# EAGLE design EsquematicoPotencia (EAGLE 9.1.3)
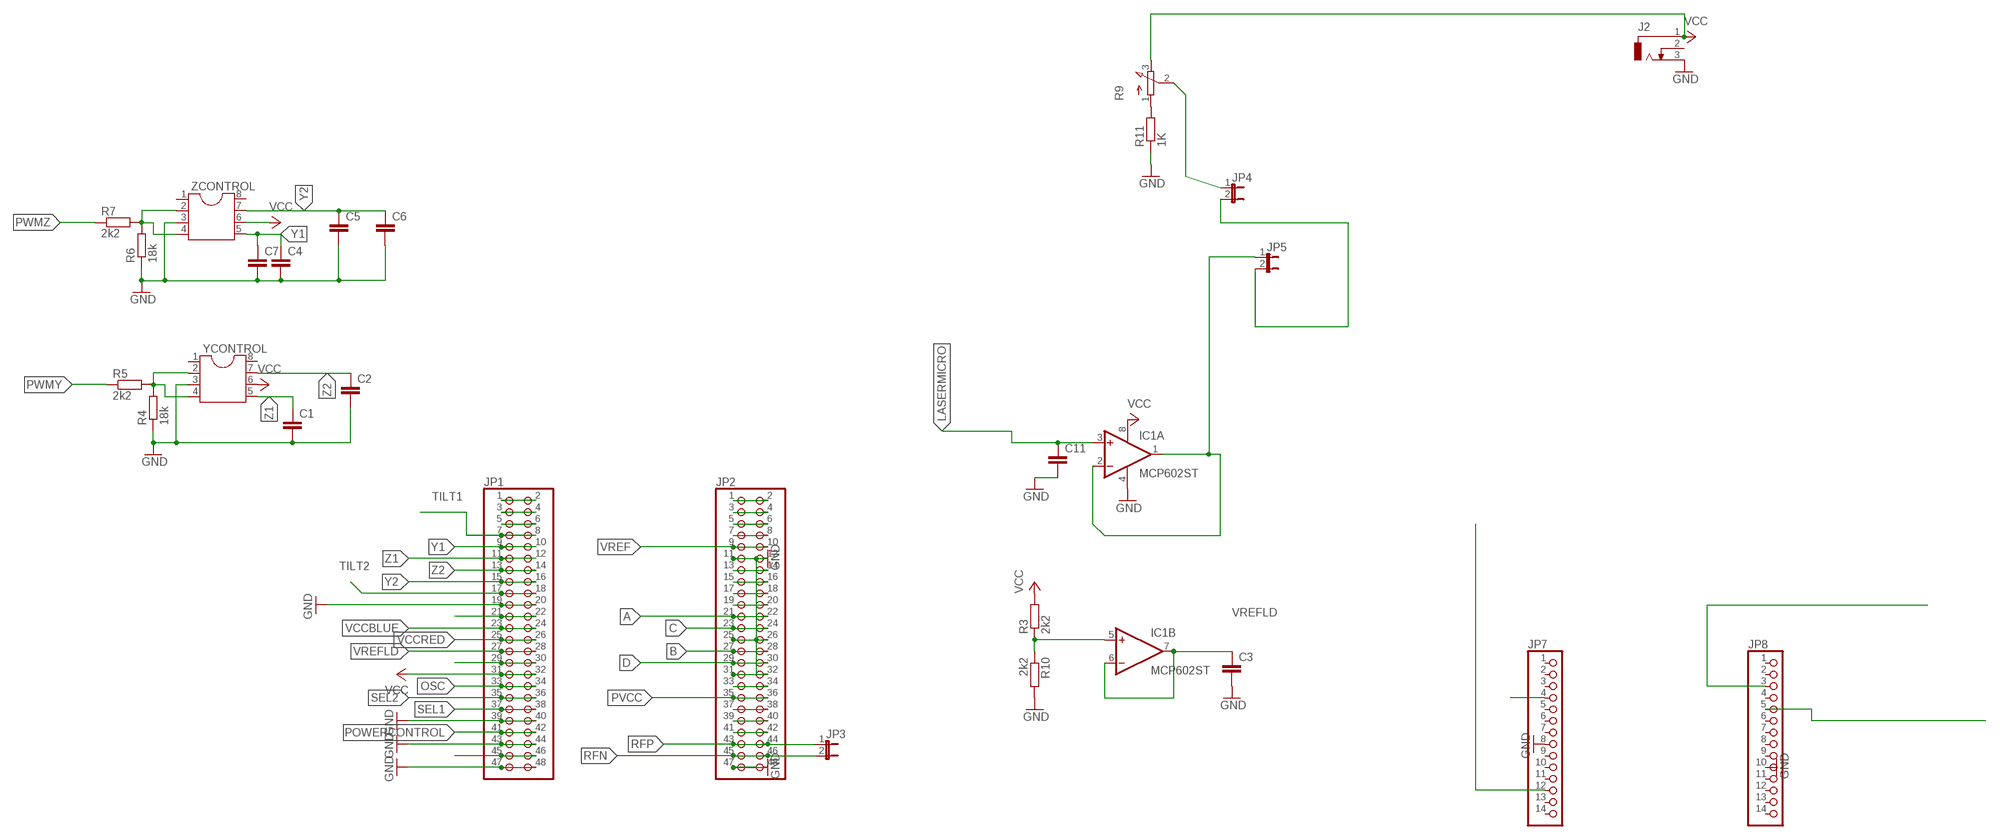
[diagram p0: schematic, sheet 1]

## Parts
C1  C-EU025-024X044  [C025-024X044]
C2  C-EU025-024X044  [C025-024X044]
C3  C-EU025-024X044  [C025-024X044]
C4  C-EU025-024X044  [C025-024X044]
C5  C-EU025-024X044  [C025-024X044]
C6  C-EU025-024X044  [C025-024X044]
C7  C-EU025-024X044  [C025-024X044]
C11  C-EU025-024X044  [C025-024X044]
IC1  MCP602ST  [TSSOP8]
J2  DCJ0303  [DCJ0303]
JP1  PINHD-2X24  [2X24]
JP2  PINHD-2X24  [2X24]
JP3  JP1E  [JP1]
JP4  JP1E  [JP1]
JP5  JP1E  [JP1]
JP7  PINHD-1X14  [1X14]
JP8  PINHD-1X14  [1X14]
R3  2k2  R-EU_0204/7  [0204/7]
R4  18k  R-EU_0204/7  [0204/7]
R5  2k2  R-EU_0204/7  [0204/7]
R6  18k  R-EU_0204/7  [0204/7]
R7  2k2  R-EU_0204/7  [0204/7]
R9  3RP/1610N  [3RP/1610N]
R10  2k2  R-EU_0204/7  [0204/7]
R11  1K  R-EU_0204/7  [0204/7]
YCONTROL  DIL8  [DIL08]
ZCONTROL  DIL8  [DIL08]

## Nets
A: JP2.21 JP2.22
B: JP2.27 JP2.28
C: JP2.23 JP2.24
D: JP2.29 JP2.30
GND: C1.2 C2.2 C3.2 C4.2 C5.2 C6.2 C7.2 C11.2 IC1.4(P:V-) J2.3 JP1.19 JP1.20 JP1.39 JP1.40 JP1.43 JP1.44 JP1.47 JP1.48 JP2.11 JP2.12 JP2.25 JP2.26 JP2.31 JP2.32 JP2.47 JP2.48 JP7.8 JP8.10 R4.1 R6.1 R10.2 R11.1 YCONTROL.3 ZCONTROL.3
LASERMICRO: C11.1 IC1.3(A:+IN) JP7.4
N$1: JP1.21 JP1.22
N$2: JP1.1 JP1.2
N$3: R9.1(A) R11.2
N$4: R4.2 R5.2 YCONTROL.2 YCONTROL.4
N$5: R6.2 R7.2 ZCONTROL.2 ZCONTROL.4
N$6: JP1.29 JP1.30
N$7: JP1.3 JP1.4
N$8: IC1.5(B:+IN) R3.1 R10.1
N$9: JP4.1 R9.2(S)
N$10: JP1.5 JP1.6
N$11: IC1.1(A:OUT) IC1.2(A:-IN) JP5.1
N$12: JP2.1 JP2.2
N$13: JP2.3 JP2.4
N$14: JP1.45 JP1.46
N$15: JP2.5 JP2.6
N$16: JP2.7 JP2.8
N$17: JP2.13 JP2.14
N$18: JP2.15 JP2.16
N$19: JP2.17 JP2.18
N$20: JP2.19 JP2.20
N$21: JP2.33 JP2.34
N$22: JP2.37 JP2.38
N$23: JP2.39 JP2.40
N$24: JP2.41 JP2.42
OSC: JP1.33 JP1.34
POWERCONTROL: JP1.41 JP1.42 JP4.2 JP5.2
PVCC: JP2.35 JP2.36
PWMTILT: JP8.5
PWMY: JP7.12 R5.1
PWMZ: JP8.3 R7.1
RFN: JP2.45 JP2.46 JP3.2
RFP: JP2.43 JP2.44 JP3.1
SEL1: JP1.37 JP1.38
SEL2: JP1.35 JP1.36
TILT1: JP1.7 JP1.8
TILT2: JP1.17 JP1.18
VCC: IC1.8(P:V+) J2.1 JP1.31 JP1.32 R3.2 R9.3(E) YCONTROL.6 ZCONTROL.6
VCCBLUE: JP1.23 JP1.24
VCCRED: JP1.25 JP1.26
VREF: JP2.9 JP2.10
VREFLD: C3.1 IC1.6(B:-IN) IC1.7(B:OUT) JP1.27 JP1.28
Y1: C4.1 C7.1 JP1.9 JP1.10 ZCONTROL.5
Y2: C5.1 C6.1 JP1.15 JP1.16 ZCONTROL.7
Z1: C1.1 JP1.11 JP1.12 YCONTROL.5
Z2: C2.1 JP1.13 JP1.14 YCONTROL.7
Unconnected: J2.2 JP7.1 JP7.2 JP7.3 JP7.5 JP7.6 JP7.7 JP7.9 JP7.10 JP7.11 JP7.13 JP7.14 JP8.1 JP8.2 JP8.4 JP8.6 JP8.7 JP8.8 JP8.9 JP8.11 JP8.12 JP8.13 JP8.14 YCONTROL.1 YCONTROL.8 ZCONTROL.1 ZCONTROL.8

## Library data of the parts
C1-C7 C11 = rcl:C-EU: CAPACITOR, European symbol; SPICEPREFIX: C
IC1 = linear:MCP602: Single Op Amp 2.7V to 6.0V Single Supply CMOS Source: http://ww1.microchip.com/downloads/en/DeviceDoc/21314g.pdf
J2 = con-jack:DCJ0303: DC POWER JACK Source: DCJ0303.pdf; OC_FARNELL: unknown; OC_NEWARK: unknown
JP1 JP2 = pinhead:PINHD-2X24: PIN HEADER
JP3-JP5 = jumper:JP1E: JUMPER
JP7 JP8 = pinhead:PINHD-1X14: PIN HEADER
R3-R7 R10 R11 = rcl:R-EU_: RESISTOR, European symbol; SPICEPREFIX: R
R9 = pot:3RP/1610N: 16mm Potentiometer one level Source: http://www.alphapotentiometers.net/html/16mm_pot_2.html
YCONTROL ZCONTROL = ic-package:DIL8: Dual In Line / Socket

## Board
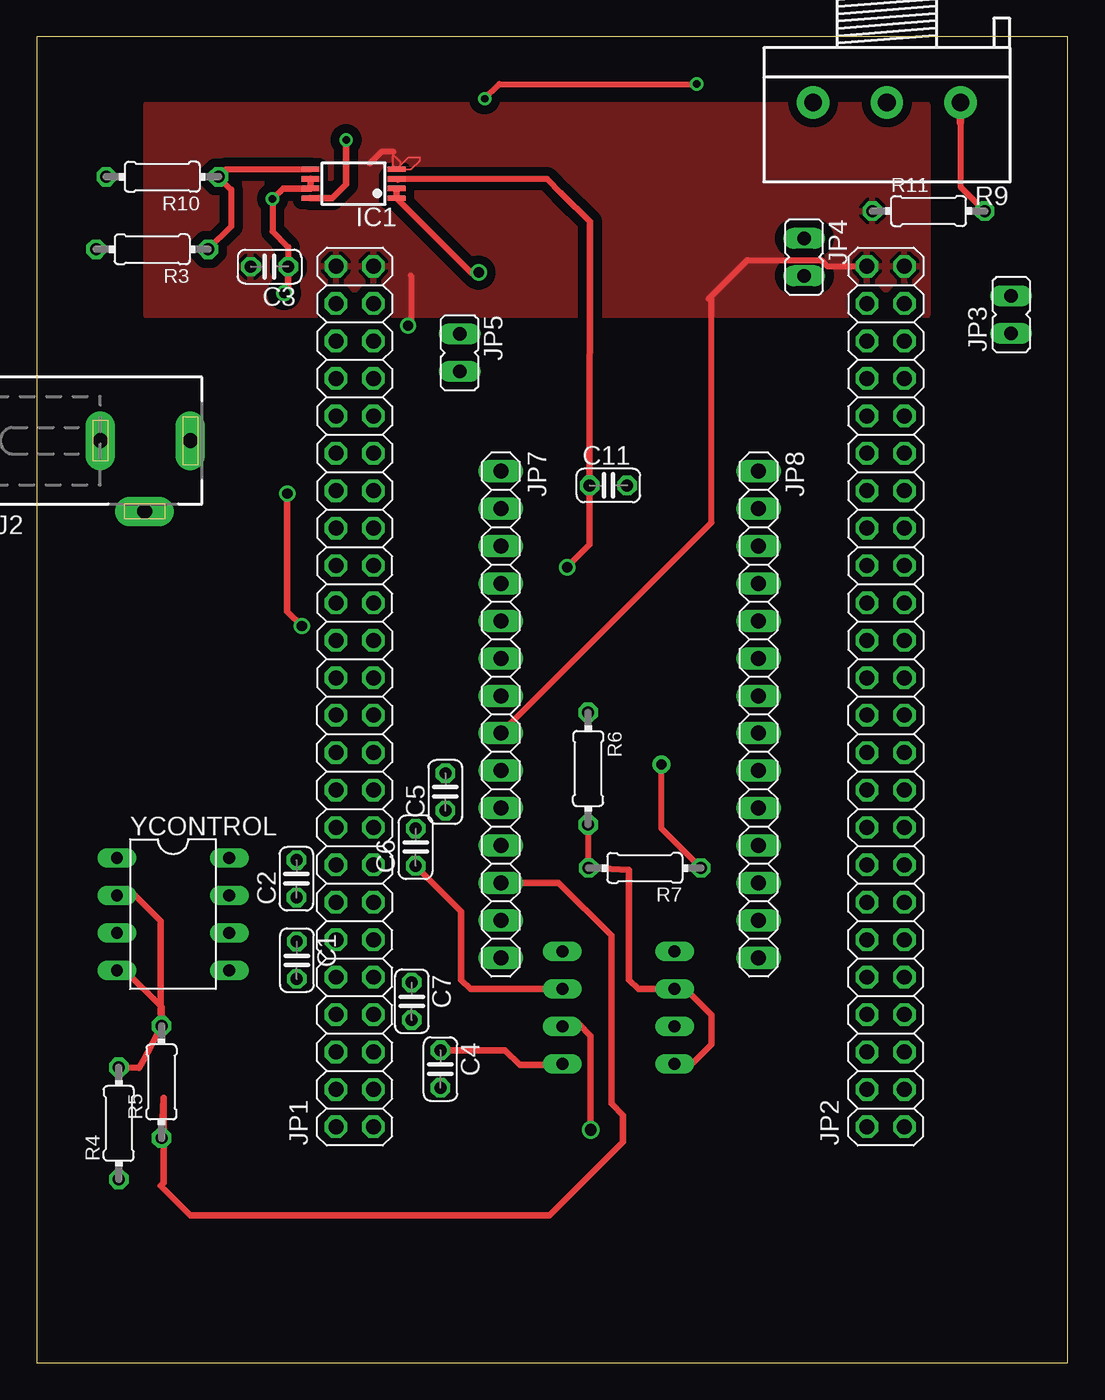
[diagram p1: board, top side]
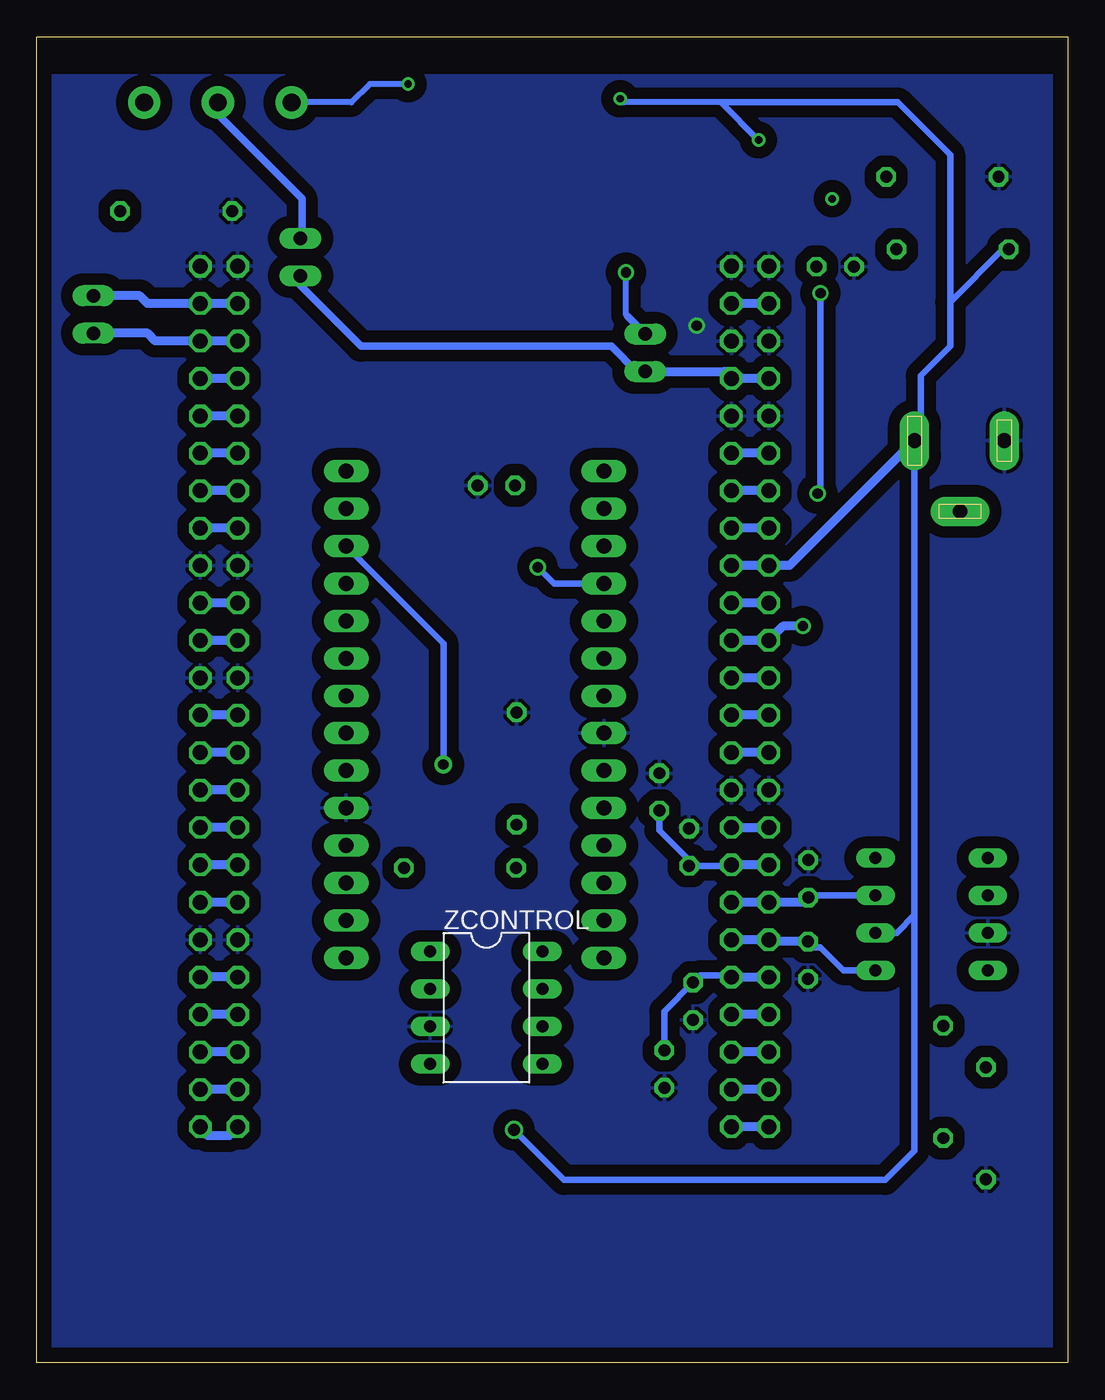
[diagram p2: board, bottom side, seen from below]

Size 70 x 90 mm. Coordinates in mm from the lower left corner, seen from the top.
Outline: 0,0 70,0 70,90 0,90 0,0
Copper layers (1*16): Top 0.035mm / dielectric 1.5mm / Bottom 0.035mm
Design rules "default *": minimum track width 6mil, minimum drill 0.5mm, track to track 6mil, track to pad 6mil, pad to pad 6mil, via to via 6mil, smd to smd 6mil, copper to edge 40mil, drill to drill 6mil, minimum pad ring 10mil, minimum via ring 8mil, stop-mask expansion 4mil, vias tented up to drill 0mil, thermal gap 10mil

### Footprints (pad centres in the part's own frame; a part is rotated, then mirrored left to right if it is on the bottom)
C025-024X044 = drill 0.813 octagon: 1 -1.27,0; 2 1.27,0
TSSOP8 = smd 0.35 x 1.2: 1 -0.975,-2.925; 2 -0.325,-2.925; 3 0.325,-2.925; 4 0.975,-2.925; 5 0.975,2.925; 6 0.325,2.925; 7 -0.325,2.925; 8 -0.975,2.925
DCJ0303 = drill 1 pad 2 long: 1 0,3.1; 2 4.8,0; 3 0,-3
2X24 = drill 1.016 octagon: 1 -27.94,-1.27; 2 -27.94,1.27; 3 -25.4,-1.27; 4 -25.4,1.27; 5 -22.86,-1.27; 6 -22.86,1.27; 7 -20.32,-1.27; 8 -20.32,1.27; 9 -17.78,-1.27; 10 -17.78,1.27; 11 -15.24,-1.27; 12 -15.24,1.27; 13 -12.7,-1.27; 14 -12.7,1.27; 15 -10.16,-1.27; 16 -10.16,1.27; 17 -7.62,-1.27; 18 -7.62,1.27; 19 -5.08,-1.27; 20 -5.08,1.27; 21 -2.54,-1.27; 22 -2.54,1.27; 23 0,-1.27; 24 0,1.27; 25 2.54,-1.27; 26 2.54,1.27; 27 5.08,-1.27; 28 5.08,1.27; 29 7.62,-1.27; 30 7.62,1.27; 31 10.16,-1.27; 32 10.16,1.27; 33 12.7,-1.27; 34 12.7,1.27; 35 15.24,-1.27; 36 15.24,1.27; 37 17.78,-1.27; 38 17.78,1.27; 39 20.32,-1.27; 40 20.32,1.27; 41 22.86,-1.27; 42 22.86,1.27; 43 25.4,-1.27; 44 25.4,1.27; 45 27.94,-1.27; 46 27.94,1.27; 47 30.48,-1.27; 48 30.48,1.27
JP1 = drill 0.914 long: 1 0,-1.27; 2 0,1.27
1X14 = drill 1.016 long: 1 -16.51,0; 2 -13.97,0; 3 -11.43,0; 4 -8.89,0; 5 -6.35,0; 6 -3.81,0; 7 -1.27,0; 8 1.27,0; 9 3.81,0; 10 6.35,0; 11 8.89,0; 12 11.43,0; 13 13.97,0; 14 16.51,0
0204/7 = drill 0.813 octagon: 1 -3.81,0; 2 3.81,0
3RP/1610N = drill 1.2 pad 2.184: 1 -5,0; 2 0,0; 3 5,0
DIL08 = drill 0.813 long: 1 -3.81,-3.81; 2 -1.27,-3.81; 3 1.27,-3.81; 4 3.81,-3.81; 5 3.81,3.81; 6 1.27,3.81; 7 -1.27,3.81; 8 -3.81,3.81

### Placement (x,y rotation side)
C1  17.65,27.32 270 top
C2  17.63,32.85 90 top
C3  15.8,74.4 180 top
C4  27.4,19.93 270 top
C5  27.73,38.74 90 top
C6  25.71,34.99 90 top
C7  25.45,24.54 270 top
C11  38.8,59.55 0 top
IC1  21.5,80.03 90 top
J2  7.32,62.59 270 top
JP1  21.58,43.95 90 top
JP2  57.63,43.95 90 top
JP3  66.15,71.15 0 top
JP4  52.1,75.05 180 top
JP5  28.7,68.55 180 top
JP7  31.5,44 270 top
JP8  49,44 270 top
R3  7.83,75.57 180 top
R4  5.56,16.24 90 top
R5  8.46,19.05 90 top
R6  37.43,40.33 270 top
R7  41.27,33.58 180 top
R9  57.71,85.55 180 top
R10  8.52,80.5 180 top
R11  60.54,78.17 0 top
YCONTROL  9.25,30.45 270 top
ZCONTROL  39.48,24.09 270 bottom

### Tracks (layer width: path | path; a pad name or v marks a point on that pad's centre or on a via)
A
  Bottom 0.61: JP2.22 JP2.21
B
  Bottom 0.61: JP2.28 JP2.27
C
  Bottom 0.61: JP2.24 JP2.23 58.95,43.95 59,44 | 59,44 58.75,43.75 59,44
D
  Bottom 0.61: JP2.30 JP2.29
GND  (via drill 0.7)
  Top 0.152: IC1.4 24.2,81.23 24.2,82 | 24.2,82 24.2,82.2 | IC1.4 25.41,81 26,81.6 26,81.8 25.22,81.8 24.71,81.29 | 24.71,81.29 IC1.4 | 24.71,81.29 24.71,81.49 24.2,82
  Top 0.406: JP7.8 45.8,57.03 45.8,72.2 45.6,72.2 48.25,74.85 53.25,74.85 53.67,74.43 JP2.48 | 25.4,73.8 25.4,70.6 v25.2,70.4 | 22.6,74.68 JP1.47 | 22.6,81.4 23.4,82.2 24.2,82.2
  pour Bottom (isolate 0.8): -0.64,87.38 70.27,87.38 70.27,0 -0.64,0
  pour Top (isolate 0.6): 7.45,85.4 60.45,85.4 60.45,71.1 7.45,71.1
LASERMICRO  (via drill 0.7 pad 0.8)
  Top 0.406: 24.49,80.29 IC1.3 34.65,80.36 35.6,79.4
  Top 0.45: 35.6,79.4 37.55,77.45 C11.1 37.53,55.53 v36,54
  Bottom 0.45: v36,54 34.89,52.89 JP7.4
N$1
  Bottom 0.61: JP1.22 JP1.21
N$2
  Bottom 0.61: JP1.2 JP1.1
N$3
  Top 0.406: 62.71,84.17 62.71,79.82 R11.2
  Top 0.508: R9.1 62.71,84.17
N$4
  Top 0.45: R4.2 6.96,20 7.21,20.49 R5.2 8.46,23.6 | YCONTROL.4 5.96,26.64 8.46,24.14 8.46,23.6 | YCONTROL.2 6.68,31.72 8.4,30 8.4,23.66 8.46,23.6
N$5
  Top 0.406: R6.2 37.43,33.94 37.8,33.57
  Top 0.45: R7.2 37.8,33.57 40.2,33.46 40.2,26 40.84,25.36 ZCONTROL.2 44.04,25.36 45.8,23.6 45.8,21.6 44.48,20.28 ZCONTROL.4
N$6
  Bottom 0.61: JP1.30 JP1.29
N$7
  Bottom 0.61: JP1.4 JP1.3
N$8
  Top 0.406: R3.1 13.2,77.13 13.2,79.63 R10.1 12.84,81 IC1.5
N$9
  Bottom 0.508: R9.2 57.71,84.71 52,79 52,76.42 JP4.1
N$10
  Bottom 0.61: JP1.6 JP1.5
N$11  (via drill 0.7 pad 0.9)
  Top 0.45: IC1.2 IC1.1 29.48,74 v30,74
  Bottom 0.406: 29.88,71 30,71.12 v30,74
  Bottom 0.508: JP5.1 29.88,71
N$12
  Bottom 0.61: JP2.2 56.97,15.4 58.4,15.4 58.4,15.51 JP2.1
N$13
  Bottom 0.61: JP2.4 JP2.3
N$14
  Bottom 0.61: JP1.46 JP1.45
N$15
  Bottom 0.61: JP2.6 JP2.5
N$16
  Bottom 0.61: JP2.8 JP2.7
N$17
  Bottom 0.61: JP2.14 JP2.13
N$18
  Bottom 0.61: JP2.16 JP2.15
N$19
  Bottom 0.61: JP2.18 JP2.17
N$20
  Bottom 0.61: JP2.20 JP2.19
N$21
  Bottom 0.61: JP2.34 JP2.33
N$22
  Bottom 0.61: JP2.38 JP2.37
N$23
  Bottom 0.61: JP2.40 JP2.39
N$24
  Bottom 0.61: JP2.42 JP2.41
OSC
  Bottom 0.61: JP1.34 JP1.33
POWERCONTROL
  Bottom 0.508: JP5.2 29.28,67.28 31,69 48,69 52.1,73.1 JP4.2
  Bottom 0.61: JP1.42 JP1.41 23.32,67.28 JP5.2
PVCC
  Bottom 0.61: JP2.36 JP2.35
PWMY
  Top 0.45: JP7.12 35.43,32.57 39,29 39,17.6 39.8,16.8 39.8,15 34.8,10 10.4,10 8.4,12 8.6,12.2 8.6,17.97 R5.1
PWMZ  (via drill 0.7 pad 1.2)
  Top 0.406: R7.1 42.4,36.27 v42.4,40.6
  Bottom 0.45: JP8.3 42.4,48.83 v42.4,40.6
RFN
  Bottom 0.61: JP2.46 JP2.45 | JP2.45 58.69,71.89 58.6,71.8 | 58.6,71.8 58.49,71.69 58.6,71.8 | JP2.45 62.49,71.89 63.02,72.42 JP3.2
RFP
  Bottom 0.61: JP2.44 JP2.43 61.95,69.35 62.48,69.88 JP3.1
SEL1
  Bottom 0.61: JP1.38 JP1.37
SEL2
  Bottom 0.61: JP1.36 JP1.35
TILT1
  Bottom 0.61: JP1.8 JP1.7
TILT2
  Bottom 0.61: JP1.17 JP1.18
VCC  (via drill 0.5, 0.5 pad 0.8, 0.8 pad 1.2)
  Top 0.406: v30.4,85.8 31.4,86.8 v44.8,86.8
  Top 0.45: IC1.8 20.05,79.06 21,80 v21,83 | v37.6,15.8 37.6,22.2 36.8,23 36.62,22.82 ZCONTROL.6
  Bottom 0.406: 8,72 4.43,75.57 R3.2 | 23.55,85.55 30.15,85.55 v30.4,85.8 | v44.8,86.8 47.4,86.8 48.65,85.55 R9.3
  Bottom 0.45: v21,83 23.55,85.55 11.55,85.55 8,82 8,72 8,69 10,67 10,63 J2.1 10.42,30.38 | YCONTROL.6 11.62,29.18 10.42,30.38 | 10.42,30.38 10.42,14.38 12.4,12.4 34.2,12.4 v37.6,15.8
  Bottom 0.61: J2.1 18.89,54.11 JP1.32 JP1.31
VCCBLUE
  Bottom 0.61: JP1.24 JP1.23
VCCRED
  Bottom 0.61: JP1.26 JP1.25
VREF
  Bottom 0.61: JP2.10 JP2.9
VREFLD  (via drill 0.5 pad 0.8, 0.7 pad 0.8)
  Top 0.406: v16,79 16,76.8 17.07,75.73 C3.1
  Top 0.45: IC1.6 IC1.7 16.7,79.7 v16,79 | C3.1 17.07,72.6 v16.8,72.6 | v17,59 17,51 v18,50
  Bottom 0.45: v16.8,72.6 16.8,59.2 v17,59
  Bottom 0.61: v18,50 19.34,50 JP1.28 JP1.27
Y1
  Top 0.45: C4.1 31.8,21.2 32.8,20.2 35.59,20.2 ZCONTROL.5
  Bottom 0.45: JP1.9 22.98,26.3 24.96,26.3 C7.1 27.4,23.86 C4.1
  Bottom 0.61: JP1.9 JP1.10
Y2
  Top 0.45: C6.1 28.8,30.64 28.8,26 29.44,25.36 ZCONTROL.7
  Bottom 0.45: JP1.15 22.8,33.72 23.2,33.72 C6.1 25.71,34.12 27.73,36.14 C5.1
  Bottom 0.61: JP1.16 23.13,33.79 23.2,33.72
Z1
  Bottom 0.45: YCONTROL.5 15.24,26.64 16.8,28.2 17.26,28.2 C1.1 | 22.55,28.59 JP1.11
  Bottom 0.61: C1.1 20.19,28.59 JP1.12 22.43,28.71 22.55,28.59
Z2
  Bottom 0.45: YCONTROL.7 17.49,31.72 C2.1
  Bottom 0.61: C2.1 17.96,31.25 JP1.14 JP1.13